# EAGLE design Wifi Schemati (EAGLE 9.3.0)
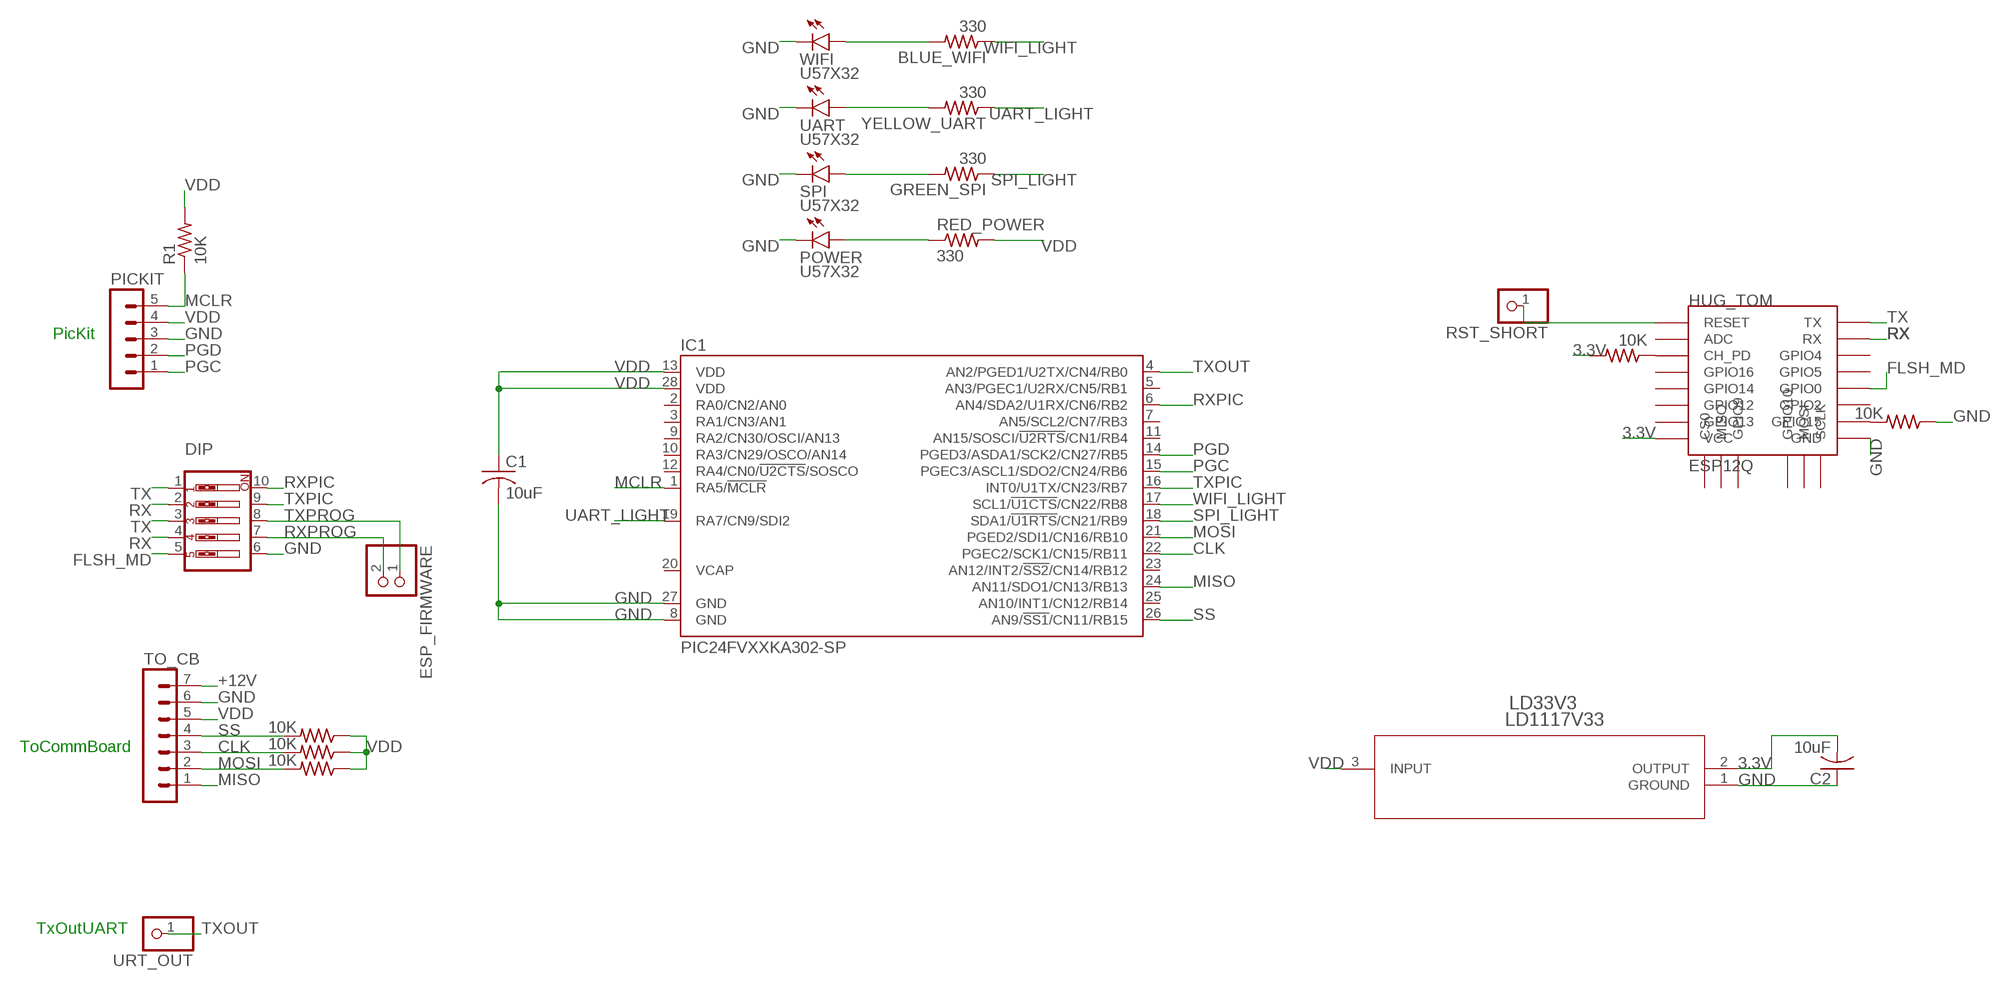
[diagram p0: schematic, sheet 1]

## Parts
BLUE_WIFI  330  R-US_0207/7  [0207/7]
C1  10uF  C-US025-025X050  [C025-025X050]
C2  10uF  C-US025-025X050  [C025-025X050]
DIP  SW_DIP-5  [EDG-05]
ESP_FIRMWARE  PINHD-1X2  [1X02]
GREEN_SPI  330  R-US_0207/7  [0207/7]
HUG_TOM  ESP12Q  [ESP12Q]
IC1  PIC24FVXXKA302-SP  [DIL28-3]
LD33V3  LD1117V33  [TO-220]
PICKIT  MA05-1  [MA05-1]
POWER  U57X32  [U57X32]
R1  10K  R-US_0207/7  [0207/7]
R2  10K  R-US_0207/7  [0207/7]
R3  10K  R-US_0207/7  [0207/7]
R4  10K  R-US_0207/7  [0207/7]
R5  10K  R-US_0207/7  [0207/7]
R6  10K  R-US_0207/7  [0207/7]
RED_POWER  330  R-US_0207/7  [0207/7]
RST_SHORT  PINHD-1X1  [1X01]
SPI  U57X32  [U57X32]
TO_CB  MA07-1  [MA07-1]
UART  U57X32  [U57X32]
URT_OUT  PINHD-1X1  [1X01]
WIFI  U57X32  [U57X32]
YELLOW_UART  330  R-US_0207/7  [0207/7]

## Nets
3.3V: C2.2 HUG_TOM.VCC LD33V3.2(OUTPUT) R6.2
+12V: TO_CB.7
CLK: IC1.22(PGEC2/SCK1/CN15/RB11) R3.2 TO_CB.3
FLSH_MD: DIP.5 HUG_TOM.GPIO0
GND: C1.2 C2.1 DIP.6 HUG_TOM.GND IC1.8(GND) IC1.27(GND) LD33V3.1(GROUND) PICKIT.3 POWER.K(C) R2.1 SPI.K(C) TO_CB.6 UART.K(C) WIFI.K(C)
MCLR: IC1.1(RA5/!MCLR) PICKIT.5 R1.1
MISO: IC1.24(AN11/SDO1/CN13/RB13) TO_CB.1
MOSI: IC1.21(PGED2/SDI1/CN16/RB10) R4.2 TO_CB.2
N$1: HUG_TOM.RESET RST_SHORT.1
N$2: HUG_TOM.GPIO15 R2.2
N$6: HUG_TOM.CH_PD R6.1
N$7: POWER.A RED_POWER.1
N$8: GREEN_SPI.2 SPI.A
N$10: UART.A YELLOW_UART.2
N$11: BLUE_WIFI.2 WIFI.A
PGC: IC1.15(PGEC3/ASCL1/SDO2/CN24/RB6) PICKIT.1
PGD: IC1.14(PGED3/ASDA1/SCK2/CN27/RB5) PICKIT.2
RX: DIP.2 DIP.4 HUG_TOM.RX
RXPIC: DIP.10 IC1.6(AN4/SDA2/U1RX/CN6/RB2)
RXPROG: DIP.7 ESP_FIRMWARE.2
SPI_LIGHT: GREEN_SPI.1 IC1.18(SDA1/!U1RTS!/CN21/RB9)
SS: IC1.26(AN9/!SS1!/CN11/RB15) R5.2 TO_CB.4
TX: DIP.1 DIP.3 HUG_TOM.TX
TXOUT: IC1.4(AN2/PGED1/U2TX/CN4/RB0) URT_OUT.1
TXPIC: DIP.9 IC1.16(INT0/U1TX/CN23/RB7)
TXPROG: DIP.8 ESP_FIRMWARE.1
UART_LIGHT: IC1.19(RA7/CN9/SDI2) YELLOW_UART.1
VDD: C1.1 IC1.13(VDD) IC1.28(VDD) LD33V3.3(INPUT) PICKIT.4 R1.2 R3.1 R4.1 R5.1 RED_POWER.2 TO_CB.5
WIFI_LIGHT: BLUE_WIFI.1 IC1.17(SCL1/!U1CTS!/CN22/RB8)
Unconnected: HUG_TOM.ADC HUG_TOM.CS0 HUG_TOM.GPIO2 HUG_TOM.GPIO4 HUG_TOM.GPIO5 HUG_TOM.GPIO9 HUG_TOM.GPIO10 HUG_TOM.GPIO12 HUG_TOM.GPIO13 HUG_TOM.GPIO14 HUG_TOM.GPIO16 HUG_TOM.MISO HUG_TOM.MOSI HUG_TOM.SCLK IC1.2(RA0/CN2/AN0) IC1.3(RA1/CN3/AN1) IC1.5(AN3/PGEC1/U2RX/CN5/RB1) IC1.7(AN5/SCL2/CN7/RB3) IC1.9(RA2/CN30/OSCI/AN13) IC1.10(RA3/CN29/OSCO/AN14) IC1.11(AN15/SOSCI/!U2RTS!/CN1/RB4) IC1.12(RA4/CN0/!U2CTS!/SOSCO) IC1.20(VCAP) IC1.23(AN12/INT2/!SS2!/CN14/RB12) IC1.25(AN10/INT1/CN12/RB14)

## Notes on the sheet
- PicKit
- ToCommBoard
- TxOutUART

## Library data of the parts
BLUE_WIFI GREEN_SPI R1-R6 RED_POWER YELLOW_UART = rcl:R-US_: RESISTOR, American symbol; SPICEPREFIX: R
C1 C2 = rcl:C-US: CAPACITOR, American symbol; SPICEPREFIX: C
DIP = special:SW_DIP-5: DIP SWITCH
ESP_FIRMWARE = pinhead:PINHD-1X2: PIN HEADER
HUG_TOM = esp826612q:ESP12Q: ESP8266 Wifi module 12-Q; SPICEPREFIX: X
IC1 = pic24kakl:PIC24FVXXKA302: PIC24FVXXKA302 2.0-5.5V 28 pin
LD33V3 = 3v3 Regulator:LD1117V33; MANUFACTURER_PART_NUMBER: LD1117V33; VENDOR: STMicroelectronics
PICKIT = con-lstb:MA05-1: PIN HEADER; OC_FARNELL: unknown; OC_NEWARK: unknown
POWER SPI UART WIFI = led:U57X32: LED rectangle, 5.7 x 3.2 mm
RST_SHORT URT_OUT = pinhead:PINHD-1X1: PIN HEADER
TO_CB = con-lstb:MA07-1: PIN HEADER; OC_FARNELL: unknown; OC_NEWARK: unknown

## Board
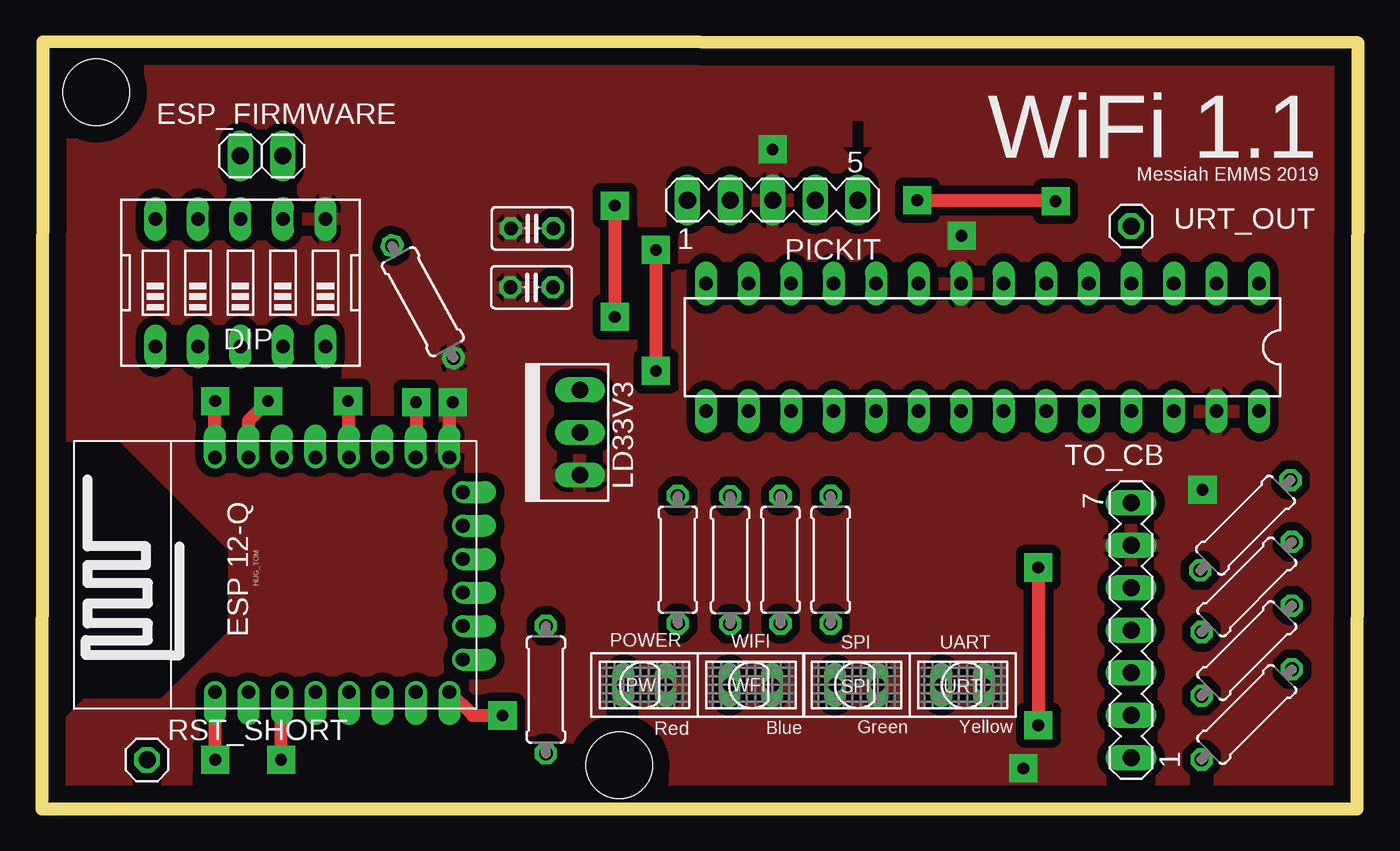
[diagram p1: board, top side]
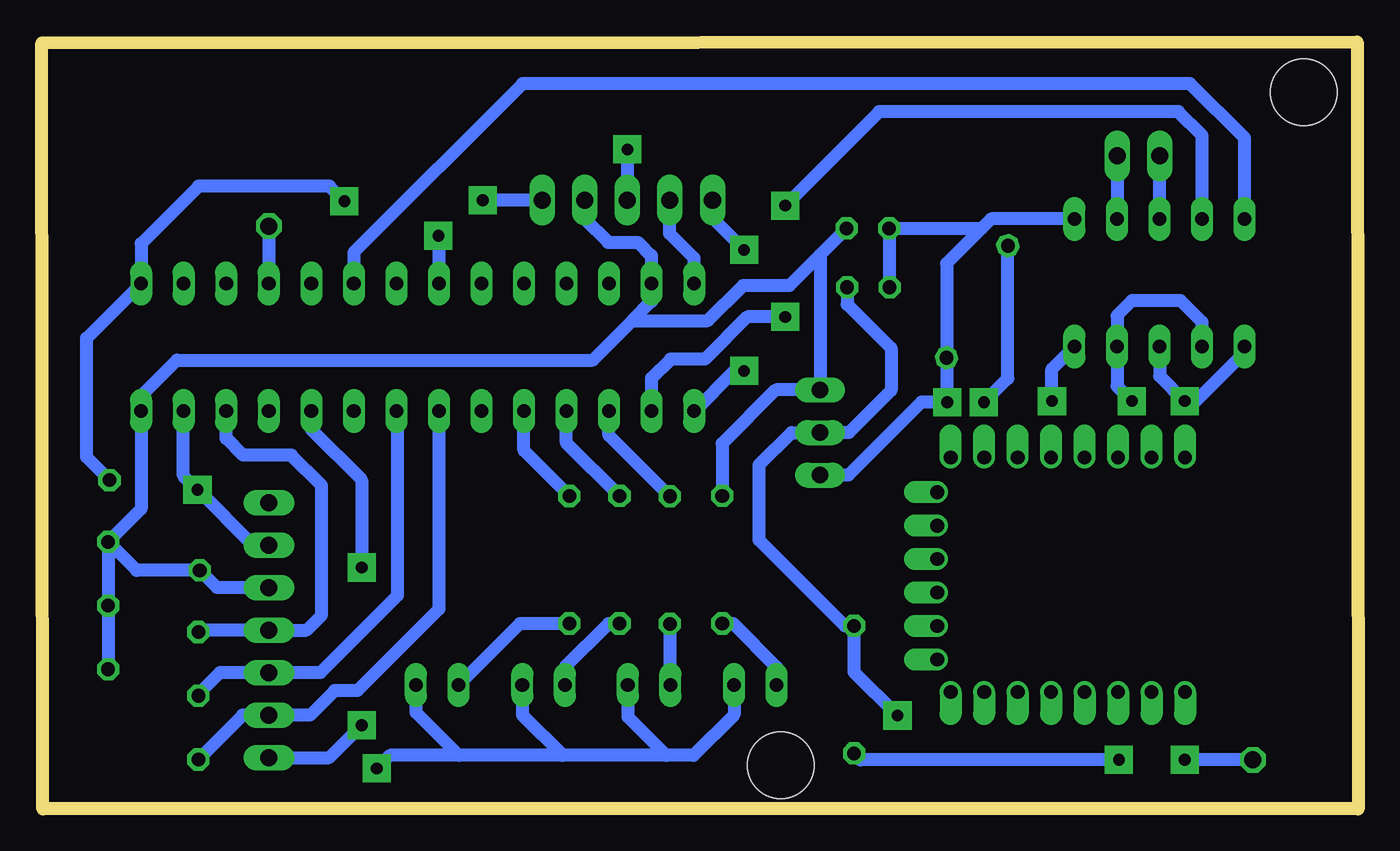
[diagram p2: board, bottom side, seen from below]

Size 78.61 x 45.81 mm. Coordinates in mm from the lower left corner, seen from the top.
Outline: 0,0 78.55,0 78.61,45.75 0.06,45.81 0,0
Copper layers (1*16): Top 0.035mm / dielectric 1.5mm / Bottom 0.035mm
Design rules "default *": minimum track width 10mil, minimum drill 22mm, track to track 20mil, track to pad 20mil, pad to pad 20mil, via to via 20mil, smd to smd 8mil, copper to edge 40mil, drill to drill 8mil, minimum pad ring 10mil, minimum via ring 8mil, stop-mask expansion 4mil, vias tented up to drill 0mil, thermal gap 10mil
Holes 3.97 mm at 3.25,42.81 34.48,2.61

### Footprints (pad centres in the part's own frame; a part is rotated, then mirrored left to right if it is on the bottom)
0207/7 = drill 0.813 octagon: 1 -3.81,0; 2 3.81,0
C025-025X050 = drill 0.813 octagon: 1 -1.27,0; 2 1.27,0
EDG-05 = drill 0.813 long: 1 -5.08,-3.81; 2 -2.54,-3.81; 3 0,-3.81; 4 2.54,-3.81; 5 5.08,-3.81; 6 5.08,3.81; 7 2.54,3.81; 8 0,3.81; 9 -2.54,3.81; 10 -5.08,3.81
1X02 = drill 1.016 long: 1 -1.27,0; 2 1.27,0
ESP12Q = drill 0.813 offset: ADC -7.1,3.8; CH_PD -7.1,1.8; CS0 -5.165,-9.005; GND 6.9,-8.2; GPIO0 6.9,-2.2; GPIO2 6.9,-4.2; GPIO4 6.9,1.8; GPIO5 6.9,-0.2; GPIO9 -1.165,-9.005; GPIO10 0.835,-9.005; GPIO12 -7.1,-4.2; GPIO13 -7.1,-6.2; GPIO14 -7.1,-2.2; GPIO15 6.9,-6.2; GPIO16 -7.1,-0.2; MISO -3.165,-9.005; MOSI 2.835,-9.005; RESET -7.1,5.8; RX 6.9,3.8; SCLK 4.835,-9.005; TX 6.9,5.8; VCC -7.1,-8.2
DIL28-3 = drill 0.813 long: 1 -16.51,-3.81; 2 -13.97,-3.81; 3 -11.43,-3.81; 4 -8.89,-3.81; 5 -6.35,-3.81; 6 -3.81,-3.81; 7 -1.27,-3.81; 8 1.27,-3.81; 9 3.81,-3.81; 10 6.35,-3.81; 11 8.89,-3.81; 12 11.43,-3.81; 13 13.97,-3.81; 14 16.51,-3.81; 15 16.51,3.81; 16 13.97,3.81; 17 11.43,3.81; 18 8.89,3.81; 19 6.35,3.81; 20 3.81,3.81; 21 1.27,3.81; 22 -1.27,3.81; 23 -3.81,3.81; 24 -6.35,3.81; 25 -8.89,3.81; 26 -11.43,3.81; 27 -13.97,3.81; 28 -16.51,3.81
TO-220 = drill 1 long: 1 -5.08,-1.524; 2 -2.54,-1.524; 3 0,-1.524
MA05-1 = drill 1.016 long: 1 -5.08,0; 2 -2.54,0; 3 0,0; 4 2.54,0; 5 5.08,0
U57X32 = drill 0.813 long: A -1.27,0; K 1.27,0
1X01 = drill 1.016 octagon: 1 0,0
MA07-1 = drill 1.016 long: 1 -7.62,0; 2 -5.08,0; 3 -2.54,0; 4 0,0; 5 2.54,0; 6 5.08,0; 7 7.62,0

### Placement (x,y rotation side)
BLUE_WIFI  41.1,14.86 270 top
C1  29.28,34.67 180 top
C2  29.25,31.15 0 top
DIP  11.86,31.42 0 top
ESP_FIRMWARE  13.12,39 0 top
GREEN_SPI  44.11,14.88 270 top
HUG_TOM  16.13,14.08 90 top
IC1  56.17,27.56 180 top
LD33V3  30.61,25.02 90 top
PICKIT  43.64,36.35 0 top
POWER  36,7.41 0 top
R1  71.88,16.94 225 top
R2  22.75,30.29 118.7 top
R3  71.96,9.45 225 top
R4  71.96,5.64 225 top
R5  71.96,13.26 225 top
R6  30.11,7.12 90 top
RED_POWER  37.98,14.89 90 top
RST_SHORT  6.29,2.94 0 top
SPI  48.65,7.41 0 top
TO_CB  65.06,10.68 90 top
UART  55,7.41 0 top
URT_OUT  65.06,34.81 0 top
WIFI  42.35,7.41 0 top
YELLOW_UART  47.11,14.88 270 top

### Tracks (layer width: path | path; a pad name or v marks a point on that pad's centre or on a via)
3.3V  (via drill 0.7 pad 1.68)
  Top 0.762: HUG_TOM.VCC 25.73,5.58 v27.51,5.58
  Bottom 0.762: C2.2 30.52,30.13 27.9,27.52 27.9,25 30.42,22.48 LD33V3.2 33.84,22.48 35.77,20.55 35.77,16.05 30.66,10.93 R6.2 30.11,8.17 v27.51,5.58
CLK
  Bottom 0.762: IC1.22 57.38,23.69 57.38,12.74 61.99,8.14 TO_CB.3 67.98,8.14 69.27,6.85 R3.2
FLSH_MD  (via drill 0.7 pad 1.68)
  Top 0.762: v18.29,24.35 18.29,21.03 HUG_TOM.GPIO0
  Bottom 0.762: v18.29,24.35 18.29,26.27 DIP.5
GND  (via drill 0.7 pad 1.68)
  Top 0.762: v24.54,24.29 24.33,24.08 HUG_TOM.GND
  Bottom 0.762: DIP.6 21.92,35.23 22.48,34.67 | C2.1 27.98,34.64 C1.2 22.48,34.67 | v43.64,39.39 PICKIT.3 | POWER.K 37.27,5.63 39.7,3.19 41.32,3.19 | 41.32,3.19 47.51,3.19 | 47.51,3.19 53.7,3.19 | UART.K 56.27,5.76 53.7,3.19 | SPI.K 49.92,5.6 47.51,3.19 | WIFI.K 43.62,5.5 41.32,3.19 | 53.7,3.19 57.83,3.19 v58.61,2.42 | IC1.27 70.16,19.9 v69.32,19.06 66.01,15.76 TO_CB.6 | v54.93,34.23 54.9,34.2 IC1.8 | LD33V3.1 30.44,19.94 26.09,24.29 v24.54,24.29 24.54,26.91 R2.1 24.58,32.58 22.48,34.67
  pour Top: 0.35,45.71 78.54,45.71 78.54,0.03 0.09,0.03 0.09,3.64 2.67,6.23 7.25,6.23 11.51,10.48 11.51,15.58 4.8,22.29 0.35,22.29
MCLR  (via drill 0.7 pad 1.68)
  Top 0.762: v52.29,36.35 60.48,36.35 v60.54,36.29
  Bottom 0.762: PICKIT.5 | PICKIT.5 v52.29,36.35 | v60.54,36.29 61.45,37.19 69.25,37.19 72.68,33.76 IC1.1 75.95,28.11 75.95,21.01 R1.1
MISO  (via drill 0.7 pad 1.68)
  Top 0.762: v59.51,14.42 v59.51,5
  Bottom 0.762: IC1.24 62.52,22.66 59.51,19.64 v59.51,14.42 | TO_CB.1 61.45,3.06 v59.51,5
MOSI
  Bottom 0.762: IC1.21 54.9,11.93 59.77,7.06 61.12,7.06 62.59,5.6 TO_CB.2 66.62,5.6 R4.2
N$1  (via drill 0.7 pad 1.68)
  Top 0.762: HUG_TOM.RESET 10.33,2.95 v10.35,2.94
  Bottom 0.762: RST_SHORT.1 v10.35,2.94
N$2  (via drill 0.7 pad 1.68)
  Top 0.762: v22.35,24.29 22.35,21 HUG_TOM.GPIO15
  Bottom 0.762: v22.35,24.29 20.92,25.72 R2.2
N$6  (via drill 0.7 pad 1.68)
  Top 0.762: v14.29,2.94 14.29,6.93 HUG_TOM.CH_PD
  Bottom 0.762: v14.29,2.94 29.73,2.94 R6.1
N$7
  Bottom 0.762: RED_POWER.1 37.33,11.08 34.73,8.47 POWER.A
N$8
  Bottom 0.762: GREEN_SPI.2 44.76,11.07 47.38,8.45 SPI.A
N$9
  cutout Top: 48.74,38.61 49.51,39.45 49,39.45 49,41 48.48,41 48.48,39.45 47.96,39.45
N$10
  Bottom 0.762: YELLOW_UART.2 50.07,11.07 UART.A
N$11
  Bottom 0.762: BLUE_WIFI.2 41.1,7.43 WIFI.A
PGC  (via drill 0.7 pad 1.68)
  Top 0.762: v36.67,33.39 | v36.67,33.39 v36.67,26.16
  Bottom 0.762: v36.67,33.39 38.56,35.27 PICKIT.1 | IC1.15 37.26,26.16 v36.67,26.16
PGD
  Bottom 0.762: PICKIT.2 41.12,36.33 41.12,34.35 39.66,32.89 IC1.14
RX  (via drill 0.7 pad 1.68)
  Top 0.762: v13.51,24.35 12.33,23.18 HUG_TOM.RX
  Bottom 0.762: v13.51,24.35 14.4,25.24 DIP.4 14.4,29.44 14.41,29.45 13.51,30.35 10.61,30.35 9.32,29.07 DIP.2
RXPIC
  Bottom 0.762: DIP.10 6.78,40.08 10.03,43.32 49.9,43.32 59.98,33.24 IC1.6
RXPROG
  Bottom 0.762: ESP_FIRMWARE.2 DIP.7
SPI_LIGHT
  Bottom 0.762: GREEN_SPI.1 47.28,21.86 IC1.18
SS
  Bottom 0.762: R5.2 69.16,10.68 TO_CB.4 62.8,10.68 61.9,11.58 61.9,19.32 63.7,21.13 66.61,21.13 67.6,22.12 IC1.26
TX  (via drill 0.7 pad 1.68)
  Top 0.762: HUG_TOM.TX 10.33,24.34 v10.35,24.35
  Bottom 0.762: DIP.1 6.78,27.28 9.7,24.35 v10.35,24.35 11.86,25.86 DIP.3
TXOUT
  Bottom 0.762: URT_OUT.1 IC1.4
TXPIC  (via drill 0.7 pad 1.68)
  Top 0.762: v34.22,36.03 v34.22,29.39
  Bottom 0.762: DIP.9 9.32,40.23 10.74,41.64 28.61,41.64 v34.22,36.03 | v34.22,29.39 36.48,29.39 39,26.87 41.06,26.87 42.2,25.73 IC1.16
TXPROG
  Bottom 0.762: DIP.8 ESP_FIRMWARE.1
UART_LIGHT
  Bottom 0.762: YELLOW_UART.1 49.82,21.41 IC1.19
VDD
  Bottom 0.762: RED_POWER.2 37.98,21.82 34.78,25.02 LD33V3.3 32.14,33.09 | C1.1 32.14,33.09 | 32.14,33.09 33.97,31.26 36.74,31.26 38.83,29.16 43.35,29.16 | PICKIT.4 46.18,35.22 44.8,33.84 43,33.84 42.2,33.05 IC1.13 42.2,30.31 43.35,29.16 | 43.35,29.16 45.7,26.81 70.54,26.81 72.68,24.67 IC1.28 72.68,17.92 R5.1 | R5.1 72.95,14.25 R1.2 68.15,13.22 TO_CB.5 | R5.1 R3.1 | R3.1 | R3.1 R4.1 | R4.1
WIFI_LIGHT
  Bottom 0.762: BLUE_WIFI.1 44.74,22.31 IC1.17

### Text on the board
tPlace: Messiah EMMS 2019 | PW | WFI | SPI | URT
tNames: WiFi 1.1 | Red | Blue | Green | Yellow